# EAGLE schematic Schematic1.0 (EAGLE 9.6.2)
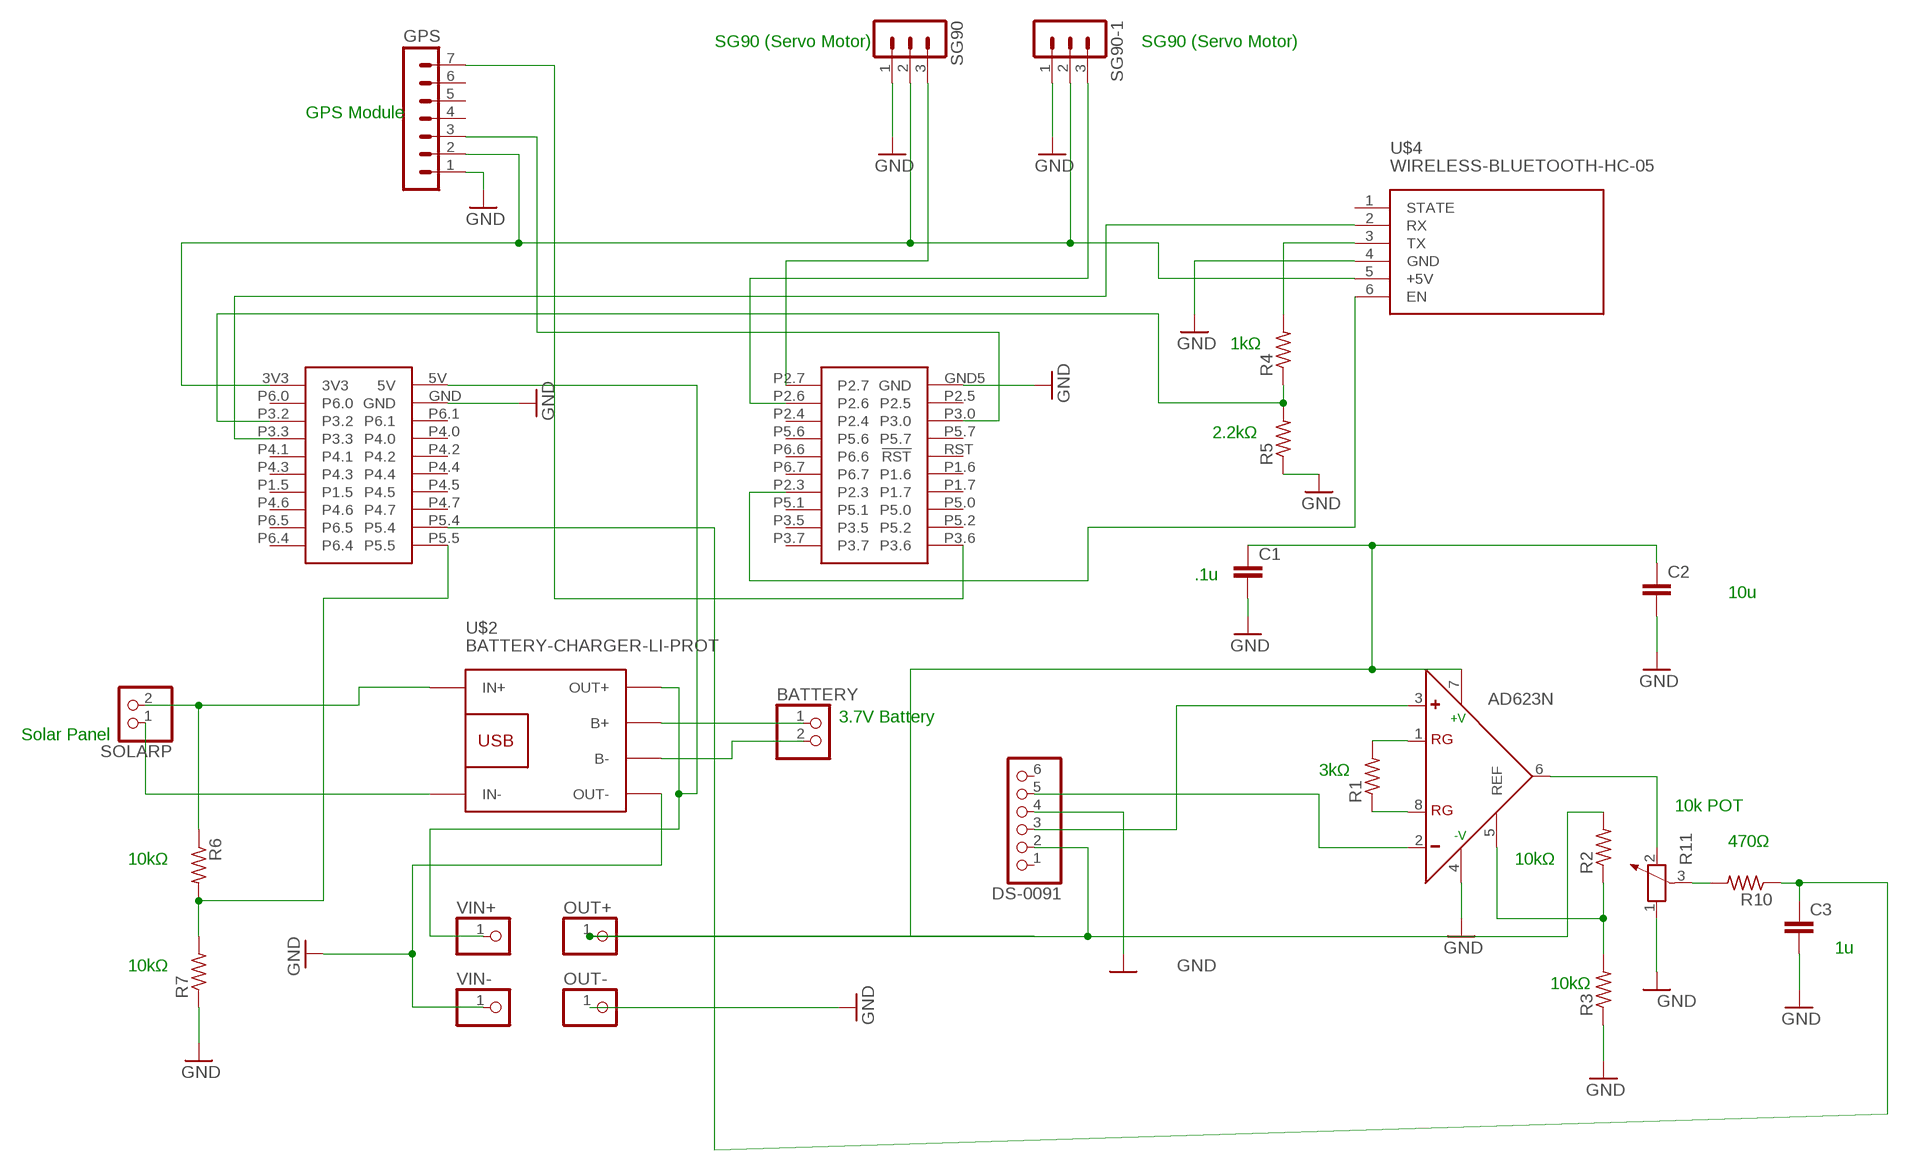
[diagram p0: schematic, sheet 1]

## Parts
BATTERY  PINHD-1X2  [1X02]
C1  C2,5-3  [C2.5-3]
C2  C2,5-3  [C2.5-3]
C3  C2,5-3  [C2.5-3]
DS-0091  PINHD-1X6  [1X06]
GPS  MA07-1  [MA07-1]
IC1  AD623N  [DIL08]
OUT+  PINHD-1X1  [1X01]
OUT-  PINHD-1X1  [1X01]
R1  R-US_0204/7  [0204/7]
R2  R-US_0204/7  [0204/7]
R3  R-US_0204/7  [0204/7]
R4  R-US_0204/7  [0204/7]
R5  R-US_0204/7  [0204/7]
R6  R-US_0204/7  [0204/7]
R7  R-US_0204/7  [0204/7]
R10  R-US_0204/7  [0204/7]
R11  POTENTIOMETER_PT-10  [PT-10]
SG90  MA03-1  [MA03-1]
SG90-1  MA03-1  [MA03-1]
SOLARP  PINHD-1X2  [1X02]
U$1  MSP432401R_40PIN  [MSP432P401R_40PIN]
U$2  BATTERY-CHARGER-LI-PROT  [BATTERY-CHARGER-LI-PROT]
U$4  WIRELESS-BLUETOOTH-HC-05  [WIRELESS-BLUETOOTH-HC-05]
VIN+  PINHD-1X1  [1X01]
VIN-  PINHD-1X1  [1X01]

## Nets
GND: C1.2 C2.2 C3.2 DS-0091.4 GPS.1 IC1.4(-V) OUT-.1 R3.1 R5.1 R7.1 R11.1 SG90-1.1 SG90.1 U$1.GND U$1.GND5(GND) U$2.OUT- U$4.4(GND) VIN-.1
N$1: IC1.1(RG) R1.2
N$2: IC1.8(RG) R1.1
N$4: DS-0091.3 IC1.3(+)
N$5: DS-0091.5 IC1.2(-)
N$6: GPS.2 SG90-1.2 SG90.2 U$1.3V3 U$4.5(+5V)
N$7: SG90-1.3 U$1.P2.6
N$8: SG90.3 U$1.P2.7
N$9: U$1.P2.3 U$4.6(EN)
N$10: U$1.P3.3 U$4.2(RX)
N$11: R4.2 U$4.3(TX)
N$12: R4.1 R5.2 U$1.P3.2
N$13: GPS.3 U$1.P3.0
N$14: GPS.7 U$1.P3.6
N$15: IC1.6(OUT) R11.2
N$16: R6.2 R7.2 U$1.P5.5
N$17: SOLARP.1 U$2.IN-
N$18: U$1.5V U$2.OUT+ VIN+.1
N$19: R10.2 R11.3
N$20: BATTERY.1 U$2.B+
N$21: BATTERY.2 U$2.B-
N$22: IC1.5(REF) R2.1 R3.2
N$23: R6.1 SOLARP.2 U$2.IN+
N$24: C3.1 R10.1 U$1.P5.4
N$25: C1.1 C2.1 DS-0091.2 IC1.7(+V) OUT+.1 R2.2
Unconnected: DS-0091.1 DS-0091.6 GPS.4 GPS.5 GPS.6 U$1.P1.5 U$1.P1.6 U$1.P1.7 U$1.P2.4 U$1.P2.5 U$1.P3.5 U$1.P3.7 U$1.P4.0 U$1.P4.1 U$1.P4.2 U$1.P4.3 U$1.P4.4 U$1.P4.5 U$1.P4.6 U$1.P4.7 U$1.P5.0 U$1.P5.1 U$1.P5.2 U$1.P5.6 U$1.P5.7 U$1.P6.0 U$1.P6.1 U$1.P6.4 U$1.P6.5 U$1.P6.6 U$1.P6.7 U$1.RST(!RST) U$4.1(STATE)

## Notes on the sheet
- SG90 (Servo Motor) | SG90 (Servo Motor)
- GPS Module
- 1kΩ
- 2.2kΩ
- .1u
- 10u
- 3.7V Battery
- Solar Panel
- 3kΩ
- 10k POT
- 470Ω
- 10kΩ | 10kΩ
- 1u
- 10kΩ
- 10kΩ

## Library data of the parts
BATTERY SOLARP = pinhead:PINHD-1X2: PIN HEADER
C1-C3 = capacitor-wima:C: CAPACITOR naming: grid - package width
DS-0091 = pinhead:PINHD-1X6: PIN HEADER
GPS = con-lstb:MA07-1: PIN HEADER; OC_FARNELL: unknown; OC_NEWARK: unknown
IC1 = analog-devices:AD623: Single-Supply, Rail-to-Rail, Low Cost Instrumentation Amplifier Source: http://www.analog.com/static/imported-files/data_sheets/AD623.pdf; MF: ALTERA CORPORATION; MPN: AD623ANZ; OC_FARNELL: 9603700; OC_NEWARK: 59K4402
OUT+ OUT- VIN+ VIN- = pinhead:PINHD-1X1: PIN HEADER
R1-R7 R10 = rcl:R-US_: RESISTOR, American symbol; SPICEPREFIX: R
R11 = rcl:POTENTIOMETER_: Potentiometer; SPICEMODEL: POT; SPICEPREFIX: X
SG90 SG90-1 = con-lstb:MA03-1: PIN HEADER; OC_FARNELL: unknown; OC_NEWARK: unknown
U$1 = booster:MSP432401R_40PIN: *MSP432*
U$2 = diy-modules:BATTERY-CHARGER-LI-PROT: Lithium Battery 5V Charger with protection circuit More details available here: http://www.instructables.com/id/DIY-Lithium-ion-Battery-Charger/step4/TP4056-based-lithium-ion-battery-charger-module/ Click here to find device on ebay.com <http://www.ebay.com/sch/tp4056+charger+usb+protection>
U$4 = diy-modules:WIRELESS-BLUETOOTH-HC-05: Bluetooth Transceiver Module based on HC-05 board Tutorial is available here: https://arduino-info.wikispaces.com/BlueTooth-HC05-HC06-Modules-How-To Click here to find device on ebay.com <http://www.ebay.com/sch/hc-05+module+rs232>